# Altium schematic sheet Status.SchDoc: SIM868 Development Board
size 149 x 149 mm; SheetNumber: 6; SheetTotal: 14
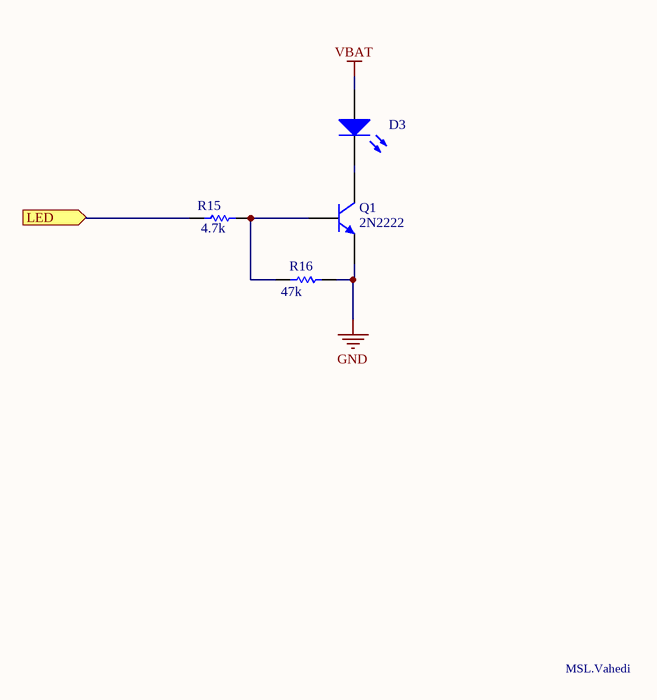
[diagram p0: Status.SchDoc]

## Parts
D3  (no value)  [LED_0805_BLUE]
Q1  2N2222  [SOT-23]
R15  value 4.7k  [RES0805]
R16  value 47k  [RES0805]

## Ports
LED (in)

## Nets
GND: Q1.1(E) R16.2
VBAT: D3.1(A)
LED: R15.1 ; port LED
NetD3_2: D3.2(K) Q1.3(C)
NetQ1_2: Q1.2(B) R15.2 R16.1

## Notes on the sheet
- MSL.Vahedi

## Library data of the parts
D3 = LED0: Typical INFRARED GaAs LED; Published: 8-Jun-2000; LatestRevisionDate: 08-Jul-2005; LatestRevisionNote: Mech Layer 1 removed.; PackageReference: LED-0; Publisher: Altium Limited; PackageDescription: LED; 2 Leads
Q1 = 2N3904: NPN General Purpose Amplifier; Published: 8-Jun-2000; LatestRevisionDate: 15-Jan-2003; LatestRevisionNote: PCB Footprint 'BCY-W3/D4.7' replaced; DatasheetVersion: 1997; PackageVersion: Sep-1998; PackageReference: TO-92A; Publisher: Altium Limited; PackageDescription: TO, Flat Index; 3 In-Line, Axial Leads; Body Dia. 4.5mm; Leads 0.51 x 0.48 mm (max); ComponentLink1Description: Manufacturer Link; ComponentLink1URL: http://www.fairchildsemi.com/; ComponentLink2Description: Datasheet; ComponentLink2URL: http://www.fairchildsemi.com/ds/2N%2F2N3904.pdf
R15 R16 = Res1: Resistor; Published: 8-Jun-2000; LatestRevisionDate: 17-Jul-2002; LatestRevisionNote: Re-released for DXP Platform.; PackageReference: AXIAL-0.3; Publisher: Altium Limited; PackageDescription: Axial Device, Thru-Hole; 2 Leads; 0.3 in Pin Spacing